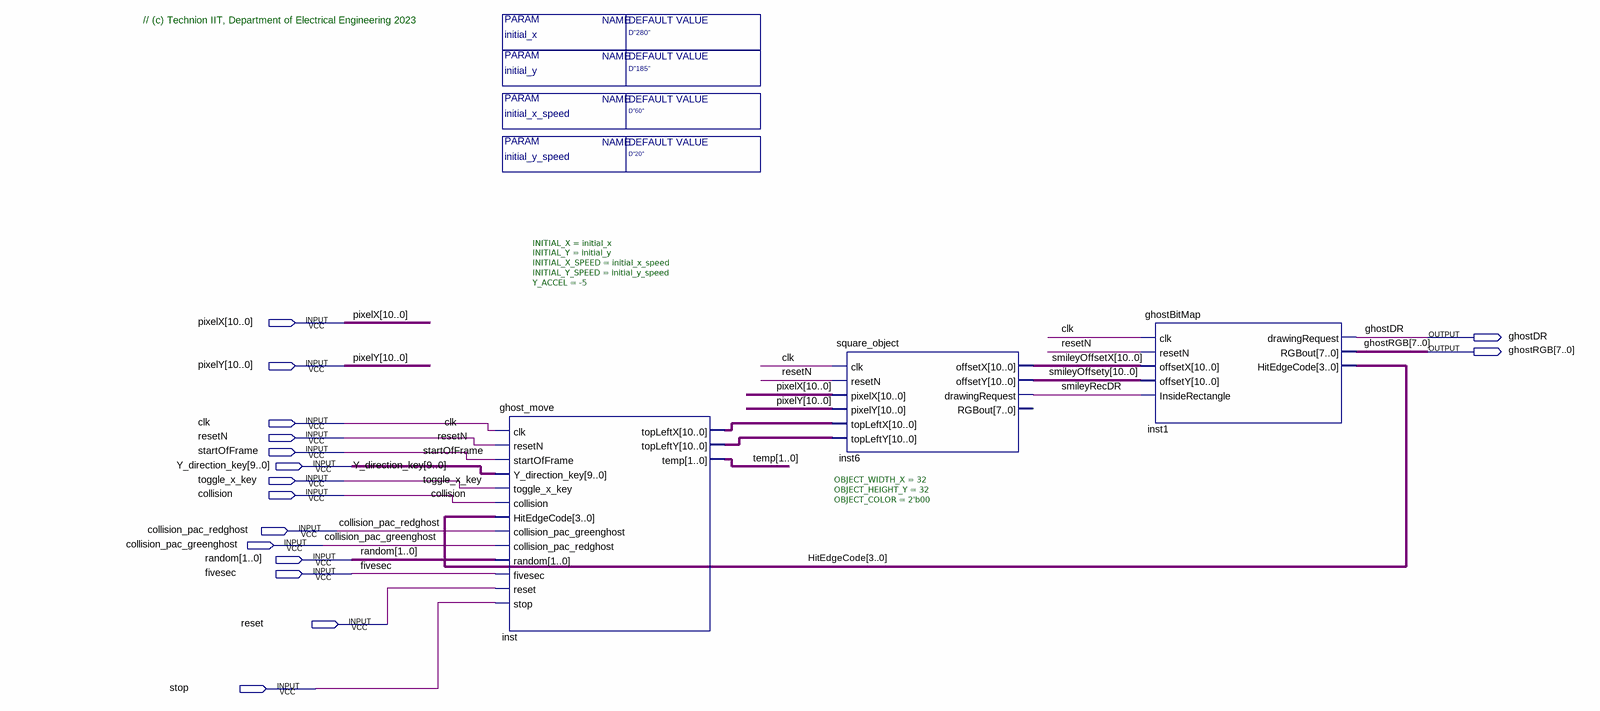
[diagram p0: schematic sheet]
// Quartus schematic Ghost_Block_T.bdf as structural Verilog: 3 symbols, 16 pins
module Ghost_Block_T #(parameter initial_x = "D\"280\"", parameter initial_y = "D\"185\"", parameter initial_x_speed = "D\"60\"", parameter initial_y_speed = "D\"20\"") (
  input  [10:0] pixelX,
  input  [10:0] pixelY,
  input  clk,
  input  resetN,
  input  startOfFrame,
  input  [9:0] Y_direction_key,
  input  toggle_x_key,
  input  collision,
  input  collision_pac_redghost,
  input  collision_pac_greenghost,
  input  [1:0] random,
  input  fivesec,
  input  reset,
  input  stop,
  output ghostDR,
  output [7:0] ghostRGB
);

  wire smileyRecDR;
  wire [1:0] temp;
  wire [3:0] HitEdgeCode;
  wire [10:0] inst_topleftx, inst_toplefty, smileyOffsetX, smileyOffsety;

  ghost_move #(.INITIAL_X(initial_x), .INITIAL_Y(initial_y), .INITIAL_X_SPEED(initial_x_speed), .INITIAL_Y_SPEED(initial_y_speed), .Y_ACCEL(-5)) inst (
    .clk(clk), .resetN(resetN), .startOfFrame(startOfFrame), .Y_direction_key(Y_direction_key),
    .toggle_x_key(toggle_x_key), .collision(collision), .HitEdgeCode(HitEdgeCode),
    .collision_pac_greenghost(collision_pac_redghost), .collision_pac_redghost(collision_pac_greenghost),
    .random(random), .fivesec(fivesec), .reset(reset), .stop(stop), .topLeftX(inst_topleftx),
    .topLeftY(inst_toplefty), .temp(temp));
  square_object #(.OBJECT_WIDTH_X(32), .OBJECT_HEIGHT_Y(32), .OBJECT_COLOR(2'b00)) inst6 (
    .clk(clk), .resetN(resetN), .pixelX(pixelX), .pixelY(pixelY), .topLeftX(inst_topleftx),
    .topLeftY(inst_toplefty), .offsetX(smileyOffsetX), .offsetY(smileyOffsety), .drawingRequest(smileyRecDR));  // open: RGBout
  ghostBitMap inst1 (
    .clk(clk), .resetN(resetN), .offsetX(smileyOffsetX), .offsetY(smileyOffsety),
    .InsideRectangle(smileyRecDR), .drawingRequest(ghostDR), .RGBout(ghostRGB), .HitEdgeCode(HitEdgeCode));

  // Notes on the sheet:
  //   // (c) Technion IIT, Department of Electrical Engineering 2023
endmodule
